# EasyEDA Pro project BLDCV6-nerdyintern.eprj, schematic Schematic1
Create Date: 2024-09-26; Page Name: P1; Project Name: BLDCV6; Schematic Name: Schematic1; Update Date: 2024-09-27; Company: EasyEDA.com; Drawn: EasyEDA; Page Size: A4; Part Number: JLCPCB-002; Reviewed: EasyEDA; Version: V0.1
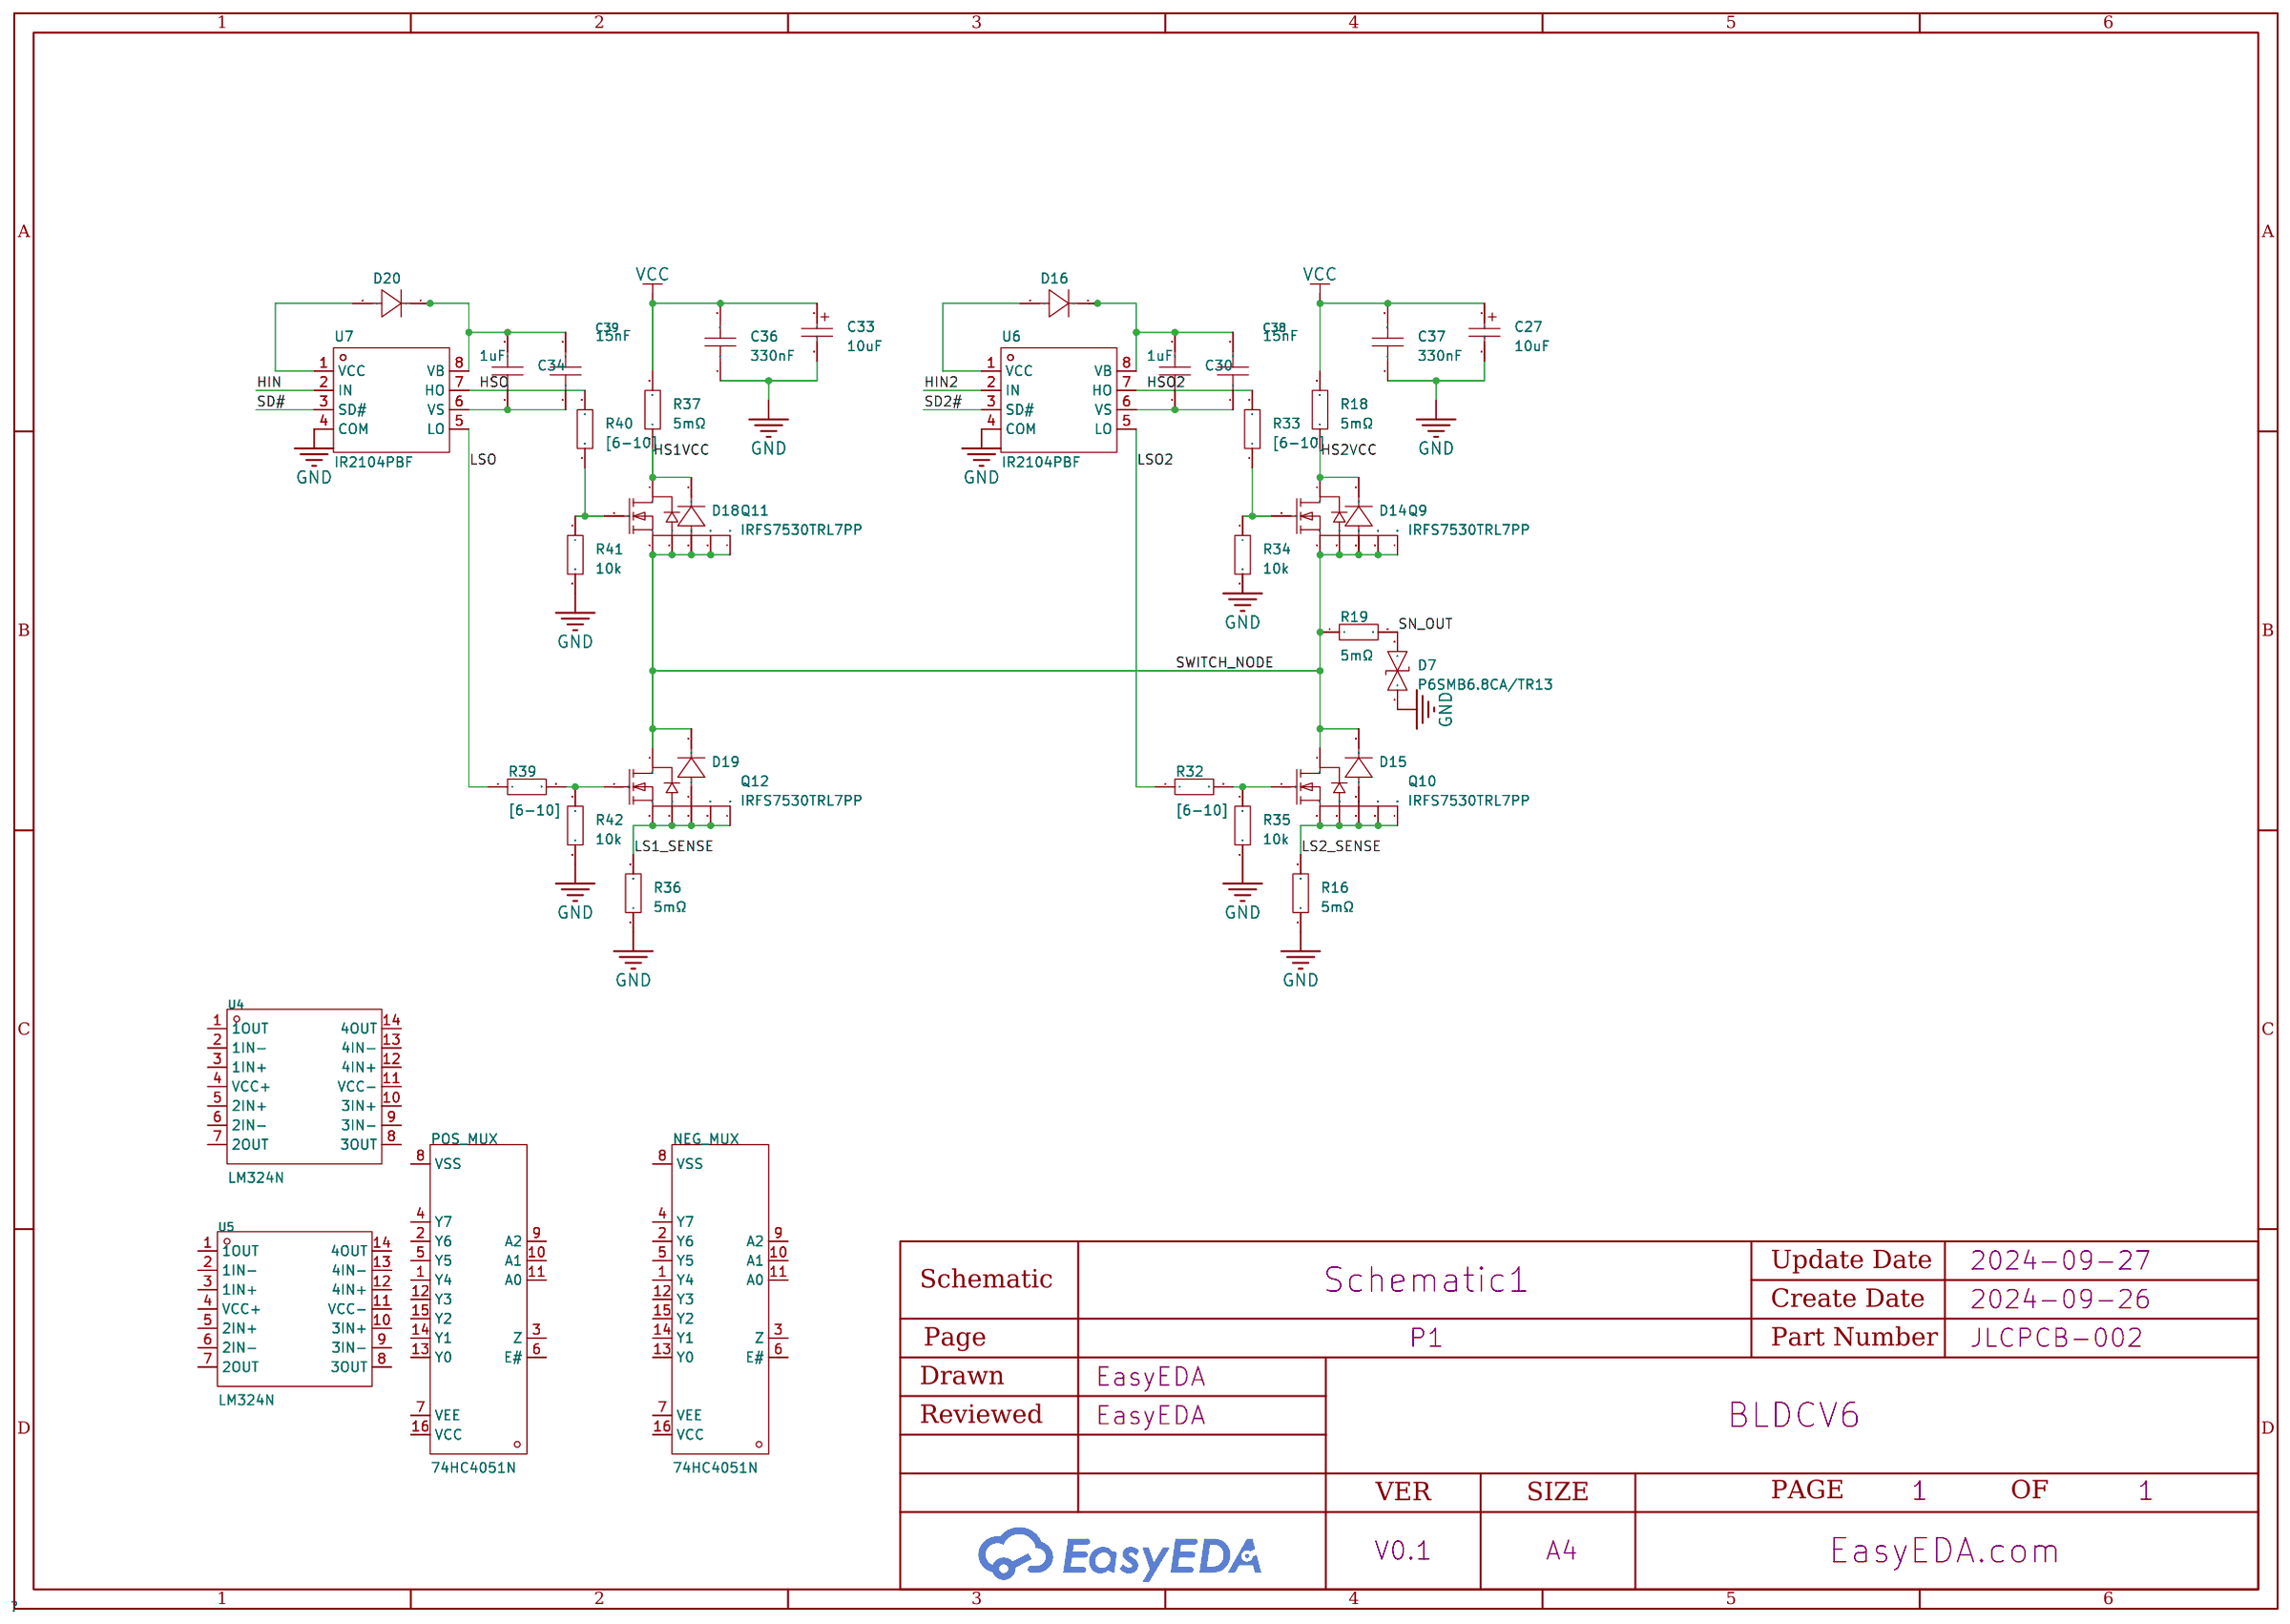
[diagram p0: schematic sheet]

## Parts
C27  10uF  [CAP-SMD_BD5.0-L5.3-W5.3-LS6.3-FD]
C30  1uF  [CAP-TH_L7.2-W2.5-P5.00-D0.6]
C33  10uF  [CAP-SMD_BD5.0-L5.3-W5.3-LS6.3-FD]
C34  1uF  [CAP-TH_L7.2-W2.5-P5.00-D0.6]
C36  330nF  [CAP-TH_L18.0-W7.5-P15.00-D0.8]
C37  330nF  [CAP-TH_L18.0-W7.5-P15.00-D0.8]
C38  15nF  [CAP-TH_L13.5-W5.5-P10.50-D1.2]
C39  15nF  [CAP-TH_L13.5-W5.5-P10.50-D1.2]
D7  P6SMB6.8CA/TR13  [SMB_L4.6-W3.6-LS5.3-BI]
D14  -  [DO-41_BD2.4-L4.7-P8.70-D0.9-RD]
D15  -  [DO-41_BD2.4-L4.7-P8.70-D0.9-RD]
D16  -  [DO-41_BD2.4-L4.7-P8.70-D0.9-RD]
D18  -  [DO-41_BD2.4-L4.7-P8.70-D0.9-RD]
D19  -  [DO-41_BD2.4-L4.7-P8.70-D0.9-RD]
D20  -  [DO-41_BD2.4-L4.7-P8.70-D0.9-RD]
NEG_MUX  74HC4051N  [PDIP-16_L19.3-W6.4-P2.54-LS7.94-BL]
POS_MUX  74HC4051N  [PDIP-16_L19.3-W6.4-P2.54-LS7.94-BL]
Q9  IRFS7530TRL7PP  [D2PAK-7_L10.6-W9.6-P1.27-LS15.9-BR]
Q10  IRFS7530TRL7PP  [D2PAK-7_L10.6-W9.6-P1.27-LS15.9-BR]
Q11  IRFS7530TRL7PP  [D2PAK-7_L10.6-W9.6-P1.27-LS15.9-BR]
Q12  IRFS7530TRL7PP  [D2PAK-7_L10.6-W9.6-P1.27-LS15.9-BR]
R16  5mΩ  [R2512]
R18  5mΩ  [R2512]
R19  5mΩ  [R2512]
R32  [6-10]  [RES-TH_BD3.3-L9.0-P13.00-D0.6]
R33  [6-10]  [RES-TH_BD3.3-L9.0-P13.00-D0.6]
R34  10k  [RES-TH_BD3.3-L9.0-P13.00-D0.6]
R35  10k  [RES-TH_BD3.3-L9.0-P13.00-D0.6]
R36  5mΩ  [R2512]
R37  5mΩ  [R2512]
R39  [6-10]  [RES-TH_BD3.3-L9.0-P13.00-D0.6]
R40  [6-10]  [RES-TH_BD3.3-L9.0-P13.00-D0.6]
R41  10k  [RES-TH_BD3.3-L9.0-P13.00-D0.6]
R42  10k  [RES-TH_BD3.3-L9.0-P13.00-D0.6]
U4  LM324N  [DIP-14_L19.3-W7.0-P2.54-LS7.6-BL]
U5  LM324N  [DIP-14_L19.3-W7.0-P2.54-LS7.6-BL]
U6  IR2104PBF  [DIP-8_L9.9-W6.6-P2.54-LS7.62-BL]
U7  IR2104PBF  [DIP-8_L9.9-W6.6-P2.54-LS7.62-BL]

## Library data of the parts
C27 C33 = C_Ele_SMD_5x5.4mm: Supplier Footprint: SMD,5x5.4mm
C30 C34 = SMEC334J100M2: Capacitance: Tolerance:±5% Tolerance:±5% Voltage Rated:; LCSC Part Name: 330nF ±5% 100V; Supplier Part: C401104; Manufacturer: CHAMPION(全鹏); Supplier Footprint: 插件,P=5mm; JLCPCB Part Class: Extended Part; Datasheet: https://atta.szlcsc.com/upload/public/pdf/source/20190730/C401104_3330673C3D333BC9993FC47731C2A492.pdf; Supplier: LCSC; Tolerance: ±5%
C36 C37 = 1DH433D400-04: Capacitance: Tolerance:±5% Tolerance:±5% Voltage Rated:; LCSC Part Name: 330nF ±5% 400V; Supplier Part: C2846751; Manufacturer: BM(丰明电容); Supplier Footprint: 插件,P=15mm; JLCPCB Part Class: Extended Part; Datasheet: https://atta.szlcsc.com/upload/public/pdf/source/20210820/3239ADB888E618FC58D2408F4FC96F9F.pdf; Supplier: LCSC; Tolerance: ±5%
C38 C39 = FGSM(161) 400VDC 153J 1A1: Capacitance: Tolerance:±5% Tolerance:±5% Voltage Rated: Operating Temperature:-40℃~+105℃ Operating Temperature:-40℃~+105℃; LCSC Part Name: 15nF ±5% 400V; Supplier Part: C185968; Manufacturer: SHINYEI(神荣); Supplier Footprint: 插件; JLCPCB Part Class: Extended Part; Supplier: LCSC; Tolerance: ±5%; Operating Temperature: -40℃~+105℃
D7 = P6SMB6.8CA/TR13: Reverse Stand-Off Voltage (Vrwm):5.8V Maximum Clamping Voltage:10.5V Peak Pulse Current (Ipp)@10/1000us:58.1A Peak Pulse Power Dissipation (Ppp)@10/1000us:600W Breakdown Voltage:6.45V Type:TVS; Supplier Part: C78395; Manufacturer: Brightking(君耀电子); Supplier Footprint: SMB(DO-214AA); JLCPCB Part Class: Basic Part; Datasheet: https://atta.szlcsc.com/upload/public/pdf/source/20160709/1468031879762.pdf; Supplier: LCSC; Reverse Stand-Off Voltage (Vrwm): 5.8V; Maximum Clamping Voltage: 10.5V; Peak Pulse Current (Ipp)@10/1000us: 58.1A; Peak Pulse Power Dissipation (Ppp)@10/1000us: 600W; Breakdown Voltage: 6.45V; Type: TVS
D14-D16 D18-D20 = 1N4007: Supplier Footprint: DO-41
NEG_MUX POS_MUX = 74HC4051N: Supplier Part: C22461600; Manufacturer: HGSEMI(华冠); Supplier Footprint: DIP-16; JLCPCB Part Class: Extended Part; Datasheet: https://atta.szlcsc.com/upload/public/pdf/source/20240606/3124DD8C3BD226D04519A3C9F1D82978.pdf; Supplier: LCSC
Q9-Q12 = IRFS7530TRL7PP: Type:1个NChannel Drain Source Voltage (Vdss): Continuous Drain Current (Id): Power Dissipation (Pd): Drain Source On Resistance (RDS(on)@Vgs,Id):1.4mΩ@10V,100A Gate Threshold Voltage (Vgs(th)@Id):3.7V@250uA Total Gate Charge (Qg@Vgs):354nC@10V Input Capaci; LCSC Part Name: 1个N沟道 耐压:60V 电流:240A; Supplier Part: C445669; Manufacturer: Infineon(英飞凌); Supplier Footprint: TO-263-7; JLCPCB Part Class: Extended Part; Datasheet: https://atta.szlcsc.com/upload/public/pdf/source/20200320/C445669_7E95350FFD1C4CDB697958F0143FEA0B.pdf; Supplier: LCSC; Type: 1个NChannel; Drain Source On Resistance (RDS(on)@Vgs,Id): 1.4mΩ@10V,100A; Gate Threshold Voltage (Vgs(th)@Id): 3.7V@250uA; Total Gate Charge (Qg@Vgs): 354nC@10V; Input Capacitance (Ciss@Vds): 12.96nF@25V; Operating Temperature: -55℃~+175℃@(Tj)
R16 R18 R19 R36 R37 = PA2512FKF7W0R005E: Type:Current Sensing Resistors Resistance: Tolerance:±1% Tolerance:±1% Power(Watts): Temperature Coefficient:±100ppm/℃ Temperature Coefficient:±100ppm/℃; LCSC Part Name: 5mΩ ±1% 2W; Supplier Part: C309526; Manufacturer: YAGEO(国巨); Supplier Footprint: 2512; JLCPCB Part Class: Extended Part; Datasheet: https://atta.szlcsc.com/upload/public/pdf/source/20190227/C375693_219964CC8B3EBD36DBDF701587FA5938.pdf; Supplier: LCSC; Type: Current Sensing Resistors; Tolerance: ±1%; Temperature Coefficient: ±100ppm/℃
R32-R35 R39-R42 = Res_AXIAL-1/2W: Supplier Footprint: Through
U4 U5 = LM324N_C114380: Number of Circuits:Quad Gain Bandwidth Product(GBP):1.2MHz Current - Input Bias(Ib):45nA Slew Rate(SR):- Output Current:40mA -3db Bandwidth:- Supply Current:1mA Operating Temperature:0℃~+70℃ Operating Temperature:0℃~+70℃; Supplier Part: C114380; Manufacturer: TI(德州仪器); Supplier Footprint: DIP-14; JLCPCB Part Class: Extended Part; Datasheet: https://www.ti.com/cn/lit/gpn/lm324; Supplier: LCSC; Number of Circuits: Quad; Gain Bandwidth Product(GBP): 1.2MHz; Current - Input Bias(Ib): 45nA; Output Current: 40mA; Supply Current: 1mA; Operating Temperature: 0℃~+70℃
U6 U7 = IR2104PBF: Driven Configuration:Half Bridge Load Type:MOSFET；IGBT Number of Drivers:2 Peak Output Current(sink):360mA Peak Output Current(source):210mA Supply Voltage:10V~20V Supply Voltage:10V~20V Rise Time:100ns Fall Time:50ns Operating Temperature:-40℃~+150℃@(Tj); LCSC Part Name: IR2104PBF 停产; Supplier Part: C2959; Manufacturer: Infineon(英飞凌); Supplier Footprint: PDIP-8; JLCPCB Part Class: Extended Part; Datasheet: https://atta.szlcsc.com/upload/public/pdf/source/20140906/1457707236579.pdf; Supplier: LCSC; Driven Configuration: Half Bridge; Load Type: MOSFET；IGBT; Number of Drivers: 2; Peak Output Current(sink): 360mA; Peak Output Current(source): 210mA; Supply Voltage: 10V~20V; Rise Time: 100ns; Fall Time: 50ns; Operating Temperature: -40℃~+150℃@(Tj)

## Nets
GND: C27.2 C33.2 C36.1 C37.1 D7.1 R16.1 R34.2 R35.2 R36.1 R41.2 R42.2 U6.4(COM) U7.4(COM)
VCC: C27.1 C33.1 C36.2 C37.2 R18.2 R37.2
HIN: U7.2(IN)
HIN2: U6.2(IN)
HS1VCC: D18.1(K) Q11.4(D) R37.1
HS2VCC: D14.1(K) Q9.4(D) R18.1
HSO: R40.2 U7.7(HO)
HSO2: R33.2 U6.7(HO)
LS1_SENSE: D19.2(A) Q12.2(S) Q12.3(S) Q12.5(S) Q12.6(S) Q12.7(S) R36.2
LS2_SENSE: Q10.2(S) Q10.3(S) Q10.5(S) Q10.6(S) Q10.7(S) R16.2
LSO: R39.1 U7.5(LO)
LSO2: R32.1 U6.5(LO)
SD2#: U6.3(SD#)
SD#: U7.3(SD#)
SN_OUT: D7.2 R19.2
SWITCH_NODE: D14.2(A) D15.1(K) D18.2(A) D19.1(K) Q9.2(S) Q9.3(S) Q9.5(S) Q9.6(S) Q9.7(S) Q10.4(D) Q11.2(S) Q11.3(S) Q11.5(S) Q11.6(S) Q11.7(S) Q12.4(D) R19.1
$1N5950: C30.2 C38.2 D16.1(K) U6.8(VB)
$1N5951: D16.2(A) U6.1(VCC)
$1N5953: C30.1 C38.1 U6.6(VS)
$1N6001: Q10.1(G) R32.2 R35.1
$1N6036: Q9.1(G) R33.1 R34.1
$1N6799: C34.2 C39.2 D20.1(K) U7.8(VB)
$1N6801: C34.1 C39.1 U7.6(VS)
$1N6814: Q12.1(G) R39.2 R42.1
$1N6817: Q11.1(G) R40.1 R41.1
$1N6828: D20.2(A) U7.1(VCC)

Not connected (* = marked no-connect by the designer): D15 2(A); NEG_MUX 1(Y4) 2(Y6) 3(Z) 4(Y7) 5(Y5) 6(E#) 7(VEE) 8(VSS) 9(A2) 10(A1) 11(A0) 12(Y3) 13(Y0) 14(Y1) 15(Y2) 16(VCC); POS_MUX 1(Y4) 2(Y6) 3(Z) 4(Y7) 5(Y5) 6(E#) 7(VEE) 8(VSS) 9(A2) 10(A1) 11(A0) 12(Y3) 13(Y0) 14(Y1) 15(Y2) 16(VCC); U4 1(1OUT) 2(1IN-) 3(1IN+) 4(VCC+) 5(2IN+) 6(2IN-) 7(2OUT) 8(3OUT) 9(3IN-) 10(3IN+) 11(VCC-) 12(4IN+) 13(4IN-) 14(4OUT); U5 1(1OUT) 2(1IN-) 3(1IN+) 4(VCC+) 5(2IN+) 6(2IN-) 7(2OUT) 8(3OUT) 9(3IN-) 10(3IN+) 11(VCC-) 12(4IN+) 13(4IN-) 14(4OUT)
